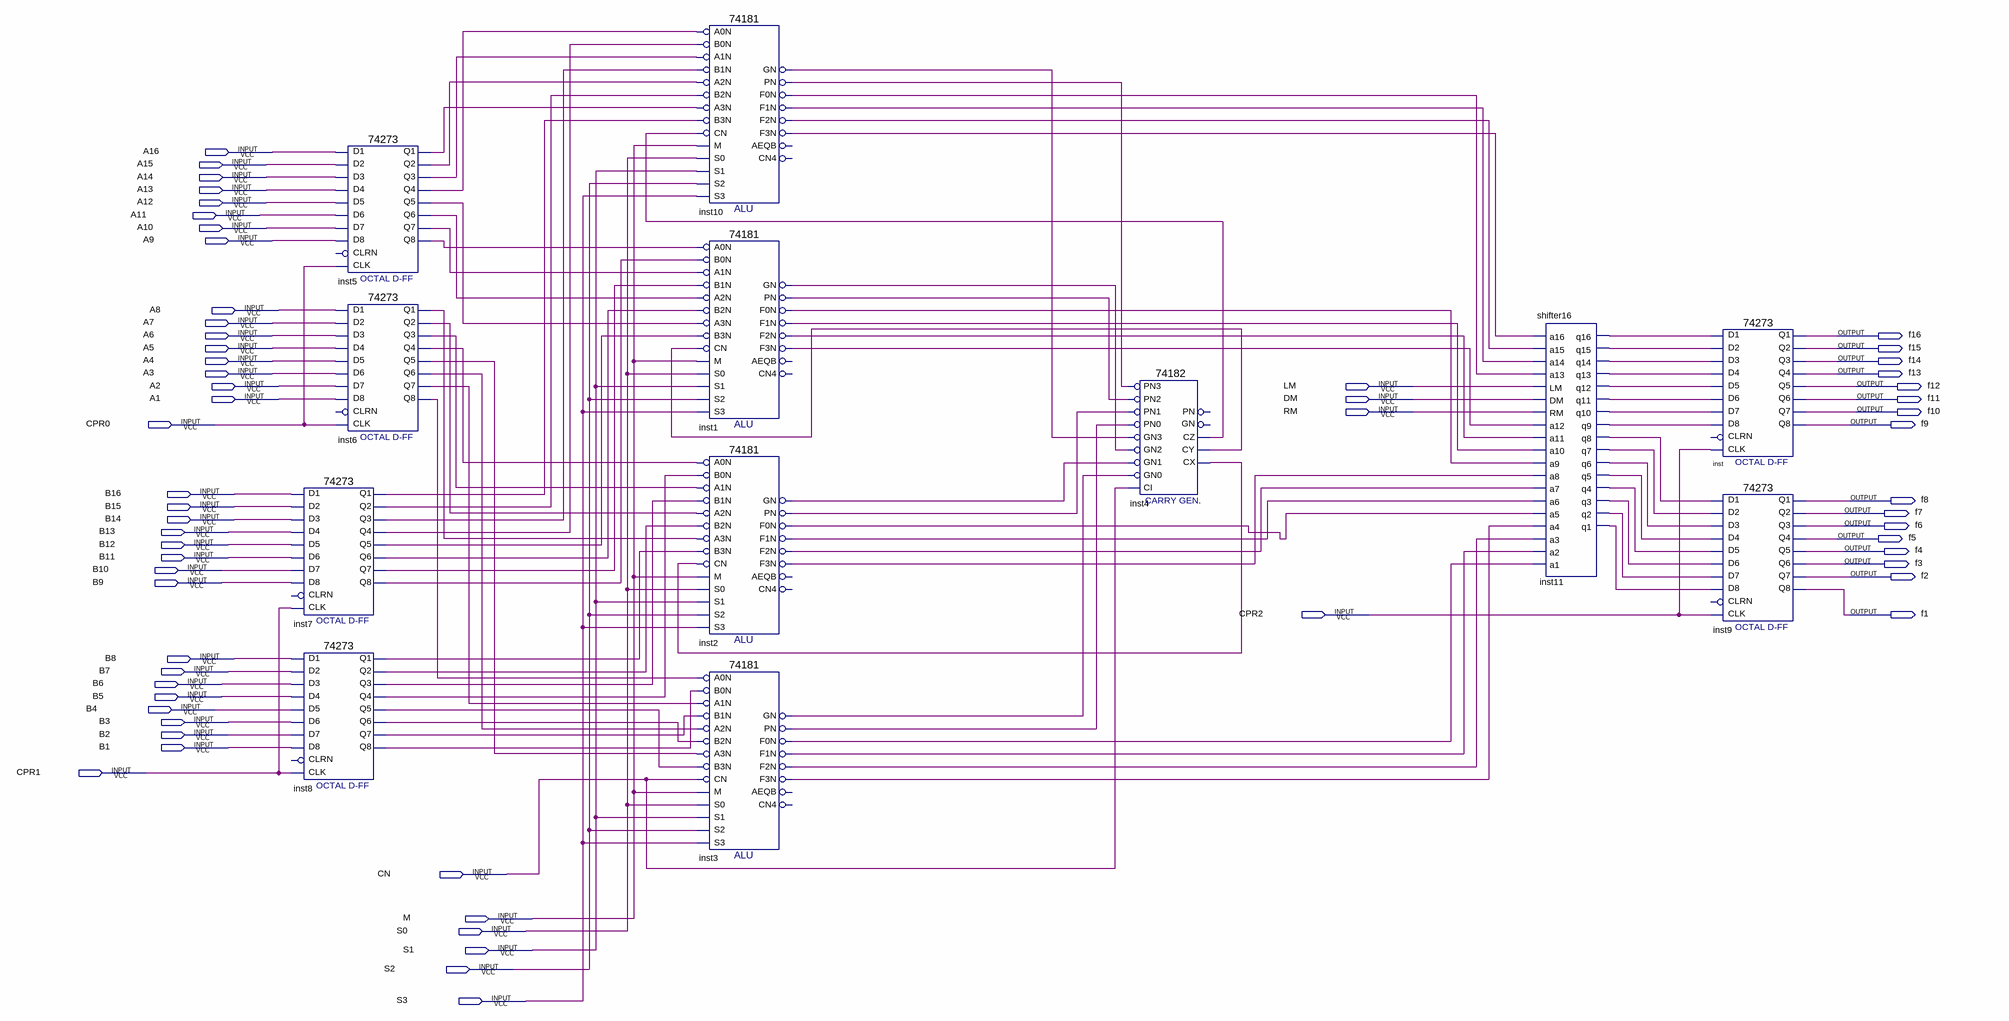
[diagram p0: schematic sheet]
// Quartus schematic 16ALU.bdf as structural Verilog: 12 symbols, 60 pins
module \16ALU  (
  input  A16,
  input  A15,
  input  A14,
  input  A13,
  input  A12,
  input  A11,
  input  A10,
  input  A9,
  input  A8,
  input  A7,
  input  A6,
  input  A5,
  input  A4,
  input  A3,
  input  A2,
  input  LM,
  input  A1,
  input  DM,
  input  RM,
  input  CPR0,
  input  B16,
  input  B15,
  input  B14,
  input  B13,
  input  B12,
  input  B11,
  input  B10,
  input  B9,
  input  CPR2,
  input  B8,
  input  B7,
  input  B6,
  input  B5,
  input  B4,
  input  B3,
  input  B2,
  input  B1,
  input  CPR1,
  input  CN,
  input  M,
  input  S0,
  input  S1,
  input  S2,
  input  S3,
  output f16,
  output f15,
  output f14,
  output f13,
  output f12,
  output f11,
  output f10,
  output f9,
  output f8,
  output f7,
  output f6,
  output f5,
  output f4,
  output f3,
  output f2,
  output f1
);

  wire inst1_f0n, inst1_f1n, inst1_f2n, inst1_f3n, inst1_gn, inst1_pn, inst2_f0n, inst2_f1n, inst2_f2n,
       inst2_f3n, inst2_gn, inst2_pn, inst3_f0n, inst3_f1n, inst3_f2n, inst3_f3n, inst3_gn, inst3_pn,
       inst4_cx, inst4_cy, inst4_cz, inst5_q1, inst5_q2, inst5_q3, inst5_q4, inst5_q5, inst5_q6, inst5_q7,
       inst5_q8, inst6_q1, inst6_q2, inst6_q3, inst6_q4, inst6_q5, inst6_q6, inst6_q7, inst6_q8, inst7_q1,
       inst7_q2, inst7_q3, inst7_q4, inst7_q5, inst7_q6, inst7_q7, inst7_q8, inst8_q1, inst8_q2, inst8_q3,
       inst8_q4, inst8_q5, inst8_q6, inst8_q7, inst8_q8, inst10_f0n, inst10_f1n, inst10_f2n, inst10_f3n,
       inst10_gn, inst10_pn, inst11_q1, inst11_q2, inst11_q3, inst11_q4, inst11_q5, inst11_q6, inst11_q7,
       inst11_q8, inst11_q9, inst11_q10, inst11_q11, inst11_q12, inst11_q13, inst11_q14, inst11_q15,
       inst11_q16;

  \74273  inst7 (
    .D2(B15), .D3(B14), .D1(B16), .D4(B13), .D7(B10), .D6(B11), .D5(B12), .D8(B9), .CLK(CPR1), .Q4(inst7_q4),
    .Q1(inst7_q1), .Q2(inst7_q2), .Q3(inst7_q3), .Q6(inst7_q6), .Q5(inst7_q5), .Q7(inst7_q7), .Q8(inst7_q8));  // open: CLRN
  \74273  inst8 (
    .D2(B7), .D3(B6), .D1(B8), .D4(B5), .D7(B2), .D6(B3), .D5(B4), .D8(B1), .CLK(CPR1), .Q4(inst8_q4),
    .Q1(inst8_q1), .Q2(inst8_q2), .Q3(inst8_q3), .Q6(inst8_q6), .Q5(inst8_q5), .Q7(inst8_q7), .Q8(inst8_q8));  // open: CLRN
  \74273  inst5 (
    .D2(A15), .D3(A14), .D1(A16), .D4(A13), .D7(A10), .D6(A11), .D5(A12), .D8(A9), .CLK(CPR0), .Q4(inst5_q4),
    .Q1(inst5_q1), .Q2(inst5_q2), .Q3(inst5_q3), .Q6(inst5_q6), .Q5(inst5_q5), .Q7(inst5_q7), .Q8(inst5_q8));  // open: CLRN
  \74273  inst6 (
    .D2(A7), .D3(A6), .D1(A8), .D4(A5), .D7(A2), .D6(A3), .D5(A4), .D8(A1), .CLK(CPR0), .Q4(inst6_q4),
    .Q1(inst6_q1), .Q2(inst6_q2), .Q3(inst6_q3), .Q6(inst6_q6), .Q5(inst6_q5), .Q7(inst6_q7), .Q8(inst6_q8));  // open: CLRN
  \74181  inst10 (
    .B0N(inst7_q4), .A0N(inst5_q4), .A1N(inst5_q3), .B1N(inst7_q3), .A3N(inst5_q1), .B2N(inst7_q2),
    .A2N(inst5_q2), .M(M), .CN(inst4_cz), .B3N(inst7_q1), .S2(S2), .S1(S1), .S0(S0), .S3(S3), .PN(inst10_pn),
    .GN(inst10_gn), .F3N(inst10_f3n), .F1N(inst10_f1n), .F0N(inst10_f0n), .F2N(inst10_f2n));  // open: AEQB, CN4
  \74181  inst1 (
    .B0N(inst7_q8), .A0N(inst5_q8), .A1N(inst5_q7), .B1N(inst7_q7), .A3N(inst5_q5), .B2N(inst7_q6),
    .A2N(inst5_q6), .M(M), .CN(inst4_cy), .B3N(inst7_q5), .S2(S2), .S1(S1), .S0(S0), .S3(S3), .PN(inst1_pn),
    .GN(inst1_gn), .F3N(inst1_f3n), .F1N(inst1_f1n), .F0N(inst1_f0n), .F2N(inst1_f2n));  // open: AEQB, CN4
  \74181  inst2 (
    .B0N(inst8_q4), .A0N(inst6_q4), .A1N(inst6_q3), .B1N(inst8_q3), .A3N(inst6_q1), .B2N(inst8_q2),
    .A2N(inst6_q2), .M(M), .CN(inst4_cx), .B3N(inst8_q1), .S2(S2), .S1(S1), .S0(S0), .S3(S3), .PN(inst2_pn),
    .GN(inst2_gn), .F3N(inst2_f3n), .F1N(inst2_f1n), .F0N(inst2_f0n), .F2N(inst2_f2n));  // open: AEQB, CN4
  \74181  inst3 (
    .B0N(inst8_q8), .A0N(inst6_q8), .A1N(inst6_q7), .B1N(inst8_q7), .A3N(inst6_q5), .B2N(inst8_q6),
    .A2N(inst6_q6), .M(M), .CN(CN), .B3N(inst8_q5), .S2(S2), .S1(S1), .S0(S0), .S3(S3), .PN(inst3_pn),
    .GN(inst3_gn), .F3N(inst3_f3n), .F1N(inst3_f1n), .F0N(inst3_f0n), .F2N(inst3_f2n));  // open: AEQB, CN4
  \74182  inst4 (
    .PN2(inst1_pn), .GN2(inst1_gn), .GN3(inst10_gn), .PN3(inst10_pn), .CI(CN), .PN1(inst2_pn),
    .PN0(inst3_pn), .GN1(inst2_gn), .GN0(inst3_gn), .CY(inst4_cy), .CX(inst4_cx), .CZ(inst4_cz));  // open: PN, GN
  shifter16 inst11 (
    .a16(inst10_f3n), .a15(inst10_f2n), .a14(inst10_f1n), .a13(inst10_f0n), .LM(LM), .DM(DM), .RM(RM),
    .a12(inst1_f3n), .a11(inst1_f2n), .a10(inst1_f1n), .a9(inst1_f0n), .a8(inst2_f3n), .a7(inst2_f2n),
    .a6(inst2_f1n), .a5(inst2_f0n), .a4(inst3_f3n), .a3(inst3_f2n), .a2(inst3_f1n), .a1(inst3_f0n),
    .q16(inst11_q16), .q15(inst11_q15), .q14(inst11_q14), .q13(inst11_q13), .q12(inst11_q12),
    .q11(inst11_q11), .q10(inst11_q10), .q9(inst11_q9), .q8(inst11_q8), .q7(inst11_q7), .q6(inst11_q6),
    .q5(inst11_q5), .q4(inst11_q4), .q3(inst11_q3), .q2(inst11_q2), .q1(inst11_q1));
  \74273  inst (
    .D2(inst11_q15), .D3(inst11_q14), .D1(inst11_q16), .D4(inst11_q13), .D7(inst11_q10), .D6(inst11_q11),
    .D5(inst11_q12), .D8(inst11_q9), .CLK(CPR2), .Q4(f13), .Q1(f16), .Q2(f15), .Q3(f14), .Q6(f11), .Q5(f12),
    .Q7(f10), .Q8(f9));  // open: CLRN
  \74273  inst9 (
    .D2(inst11_q7), .D3(inst11_q6), .D1(inst11_q8), .D4(inst11_q5), .D7(inst11_q2), .D6(inst11_q3),
    .D5(inst11_q4), .D8(inst11_q1), .CLK(CPR2), .Q4(f5), .Q1(f8), .Q2(f7), .Q3(f6), .Q6(f3), .Q5(f4),
    .Q7(f2), .Q8(f1));  // open: CLRN
endmodule
